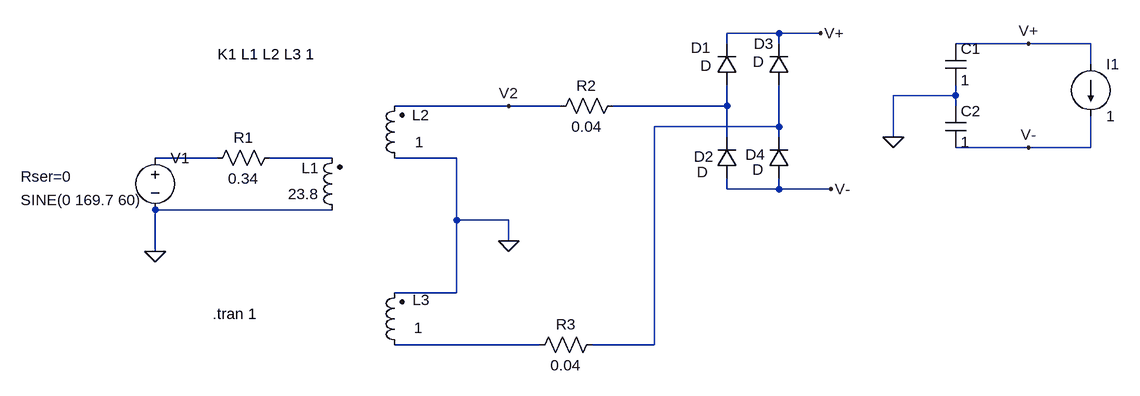
[diagram p0: schematic psu_centre_tap_gnd.asc]
psu_centre_tap_gnd.asc, the LTspice schematic file:
Version 4
SHEET 1 2164 680
WIRE 736 -32 656 -32
WIRE 800 -32 736 -32
WIRE 656 -16 656 -32
WIRE 736 -16 736 -32
WIRE 1120 -16 1008 -16
WIRE 1216 -16 1120 -16
WIRE 1216 16 1216 -16
WIRE 1008 64 1008 48
WIRE 1008 64 912 64
WIRE 320 80 144 80
WIRE 400 80 320 80
WIRE 656 80 656 48
WIRE 656 80 480 80
WIRE 1008 80 1008 64
WIRE 736 112 736 48
WIRE 736 112 544 112
WIRE 656 128 656 80
WIRE 736 128 736 112
WIRE 912 128 912 64
WIRE 1120 144 1008 144
WIRE 1216 144 1216 96
WIRE 1216 144 1120 144
WIRE -128 160 -224 160
WIRE 48 160 -48 160
WIRE 240 160 144 160
WIRE 656 208 656 192
WIRE 736 208 736 192
WIRE 736 208 656 208
WIRE 816 208 736 208
WIRE 48 240 -224 240
WIRE 240 256 240 160
WIRE 320 256 240 256
WIRE 320 288 320 256
WIRE -224 304 -224 240
WIRE 240 368 240 256
WIRE 240 368 144 368
WIRE 368 448 144 448
WIRE 544 448 544 112
WIRE 544 448 448 448
FLAG -224 304 0
FLAG 800 -32 V+
FLAG 320 80 V2
FLAG 816 208 V-
FLAG 320 288 0
FLAG 1120 -16 V+
FLAG 1120 144 V-
FLAG 912 128 0
SYMBOL ind2 64 256 R180
WINDOW 0 36 80 Left 2
WINDOW 3 36 40 Left 2
SYMATTR InstName L1
SYMATTR Value 23.8
SYMATTR Type ind
SYMATTR SpiceLine Rser=0
SYMBOL ind2 160 176 R180
WINDOW 0 -38 82 Left 2
WINDOW 3 -29 40 Left 2
SYMATTR InstName L2
SYMATTR Value 1
SYMATTR Type ind
SYMATTR SpiceLine Rser=0
SYMBOL voltage -224 144 R0
WINDOW 3 -207 81 Left 2
WINDOW 123 24 180 Left 2
WINDOW 39 -207 45 Left 2
SYMATTR Value SINE(0 169.7 60)
SYMATTR SpiceLine Rser=0
SYMATTR InstName V1
SYMBOL ind2 160 464 R180
WINDOW 0 -39 85 Left 2
WINDOW 3 -28 42 Left 2
SYMATTR InstName L3
SYMATTR Value 1
SYMATTR Type ind
SYMATTR SpiceLine Rser=0
SYMBOL diode 672 48 R180
WINDOW 0 41 58 Left 2
WINDOW 3 40 30 Left 2
SYMATTR InstName D1
SYMBOL diode 672 192 R180
WINDOW 0 36 34 Left 2
WINDOW 3 45 10 Left 2
SYMATTR InstName D2
SYMBOL diode 752 48 R180
WINDOW 0 24 64 Left 2
WINDOW 3 39 36 Left 2
SYMATTR InstName D3
SYMBOL diode 752 192 R180
WINDOW 0 37 37 Left 2
WINDOW 3 40 14 Left 2
SYMATTR InstName D4
SYMBOL res -32 144 R90
WINDOW 0 0 56 VBottom 2
WINDOW 3 32 56 VTop 2
SYMATTR InstName R1
SYMATTR Value 0.34
SYMBOL res 496 64 R90
WINDOW 0 0 56 VBottom 2
WINDOW 3 32 56 VTop 2
SYMATTR InstName R2
SYMATTR Value 0.04
SYMBOL cap 992 -16 R0
SYMATTR InstName C1
SYMATTR Value 1
SYMBOL cap 992 80 R0
SYMATTR InstName C2
SYMATTR Value 1
SYMBOL current 1216 16 R0
WINDOW 123 0 0 Left 0
WINDOW 39 0 0 Left 0
SYMATTR InstName I1
SYMATTR Value 1
SYMBOL res 464 432 R90
WINDOW 0 0 56 VBottom 2
WINDOW 3 32 56 VTop 2
SYMATTR InstName R3
SYMATTR Value 0.04
TEXT -128 0 Left 2 !K1 L1 L2 L3 1
TEXT -136 400 Left 2 !.tran 1

The netlist it stands for:
* psu_centre_tap_gnd.asc
L1 0 N004 23.8 Rser=0
L2 0 V2 1 Rser=0
V1 N003 0 SINE(0 169.7 60) Rser=0
L3 N005 0 1 Rser=0
D1 N001 V+ D
D2 V- N001 D
D3 N002 V+ D
D4 V- N002 D
R1 N004 N003 0.34
R2 N001 V2 0.04
C1 V+ 0 1
C2 0 V- 1
I1 V+ V- 1
R3 N002 N005 0.04
.model D D
.lib standard.dio
K1 L1 L2 L3 1
.tran 1
.backanno
.end

* Results of the author's LTspice run, read from the files saved beside the schematic
* Operating Point, zero values left out:
*   V(v+) = -815.9 mV
*   V(v-) = 815.9 mV
*   I(D4) = 500 mA
*   I(D3) = 500 mA
*   I(D2) = 500 mA
*   I(D1) = 500 mA
*   I(I1) = 1 A
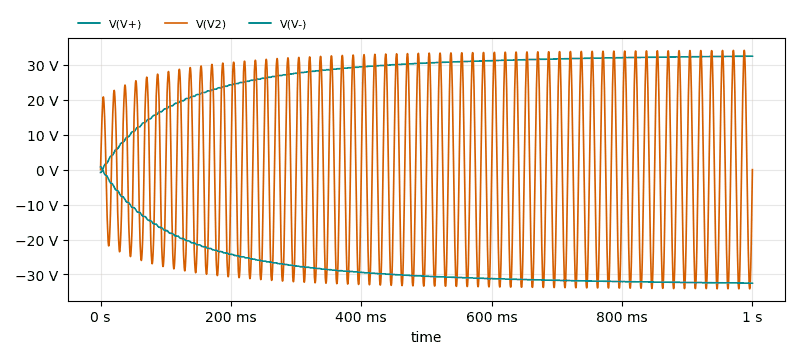
[diagram p1: Transient Analysis of psu_centre_tap_gnd.asc, plotted from the saved traces]
* Transient Analysis, 1 run:
*   V(V+): min -815.9 mV, max 32.47 V, average 27.46 V, rms 28.32 V, last 32.47 V
*   V(V2): min -34.1 V, max 34.13 V, average -95.22 mV, rms 23.2 V, last 762.4 µV
*   V(V-): min -32.47 V, max 815.9 mV, average -27.46 V, rms 28.32 V, last -32.47 V